# EAGLE design display (EAGLE 4.16)
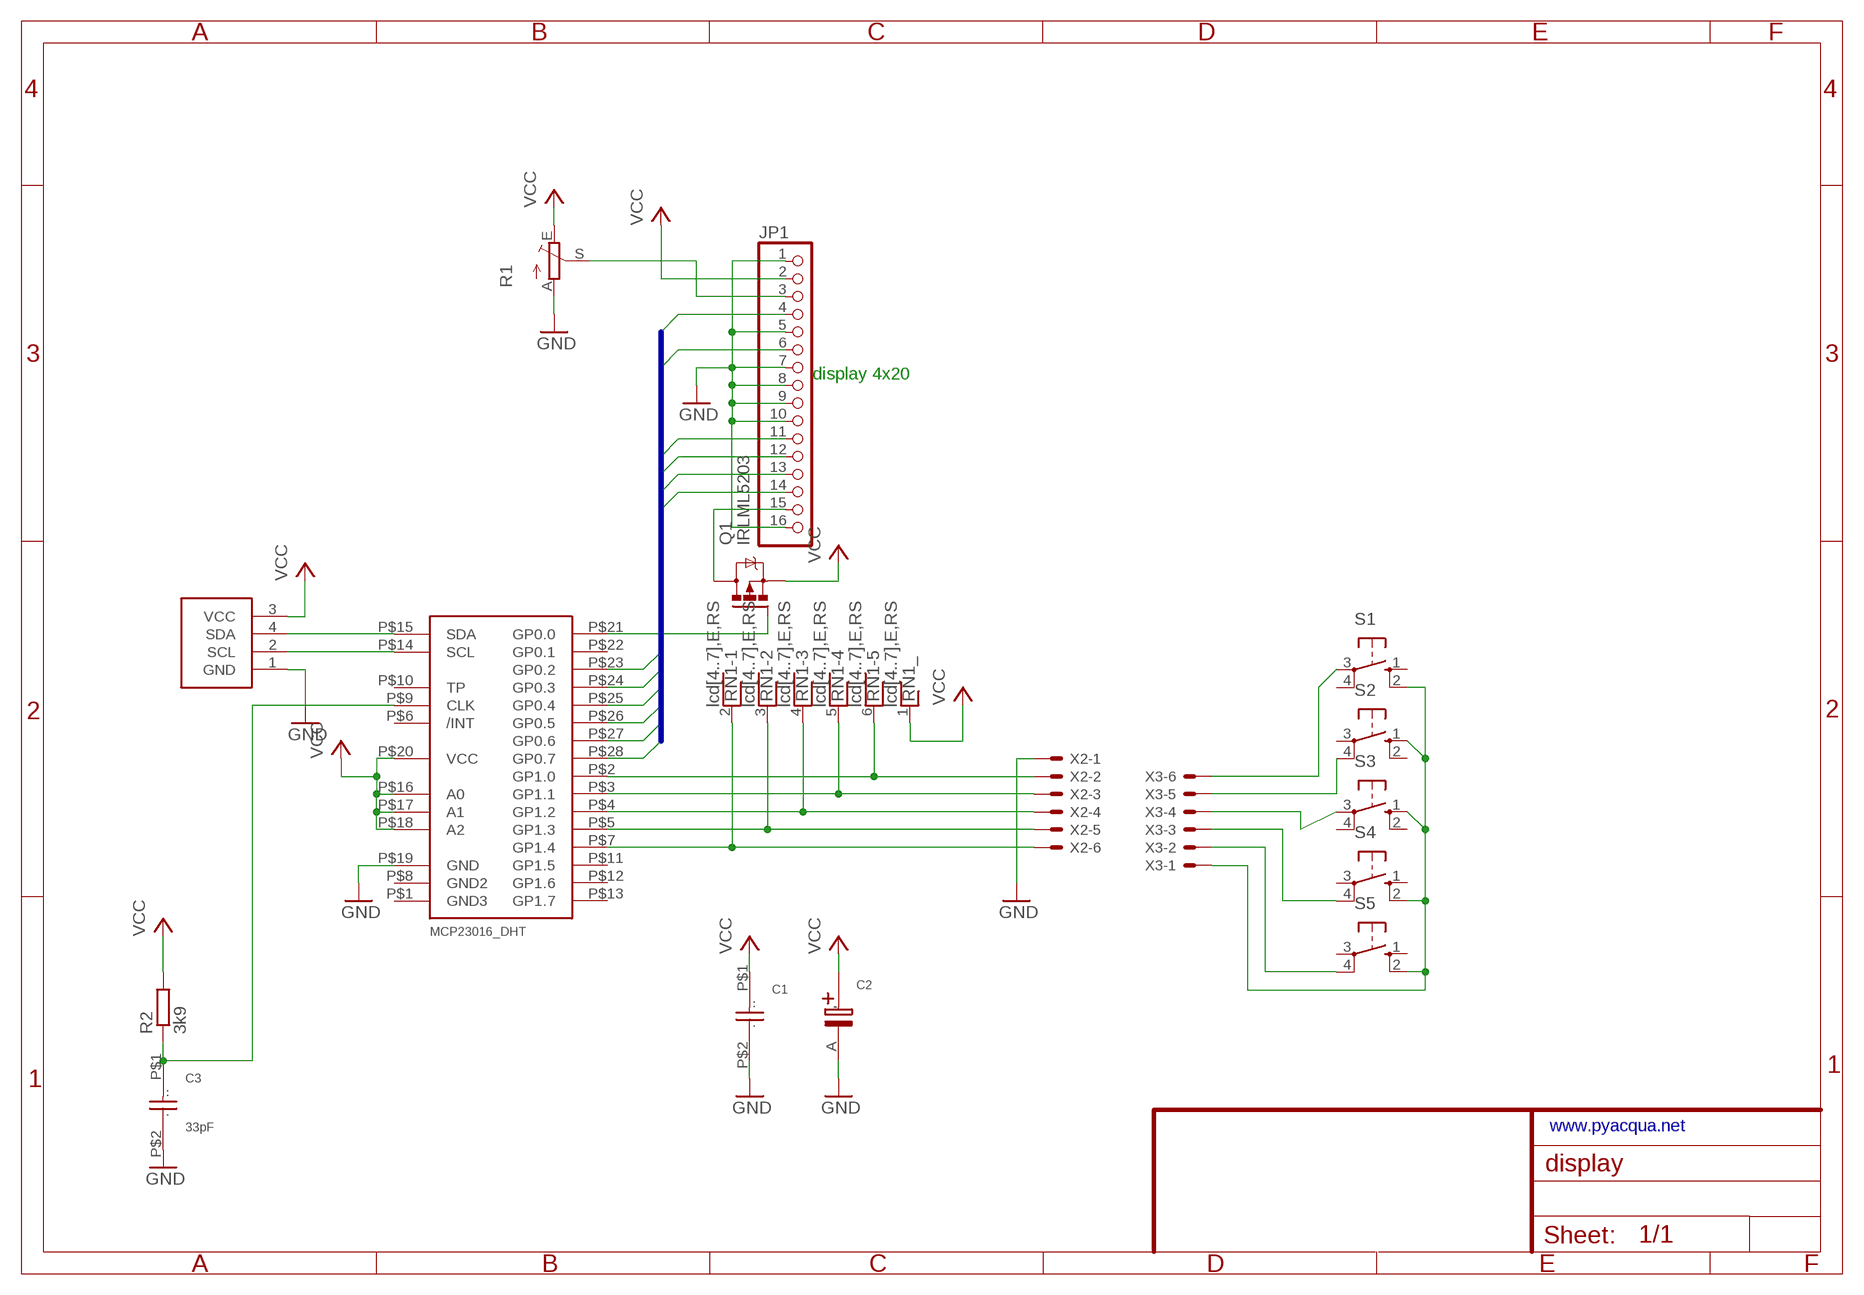
[diagram p0: schematic, sheet 1]

## Parts
C1  CAP_POLI  [CAP_POLI]
C2  CAP_ELET  [CAP_ELET]
C3  33pF  CAP_POLI  [CAP_POLI]
JP1  PINHD-1X16  [1X16]
Q1  IRLML5203  [MICRO3]
R1  TRIM_EU-LI10  [LI10]
R2  3k9  R-EU_0207/2V  [0207/2V]
RN1  lcd[4..7],E,RS  RNX5  [RN-6]
S1  10-XX  [B3F-10XX]
S2  10-XX  [B3F-10XX]
S3  10-XX  [B3F-10XX]
S4  10-XX  [B3F-10XX]
S5  10-XX  [B3F-10XX]
U$1  MCP23016_DHT  [MCP23016_DHT]
U$3  J-I2C  [J-I2C]
X2  22-23-2061  [22-23-2061]
X3  22-23-2061  [22-23-2061]

## Nets
D4: JP1.11 U$1.P$25(GP0.4)
D5: JP1.12 U$1.P$26(GP0.5)
D6: JP1.13 U$1.P$27(GP0.6)
D7: JP1.14 U$1.P$28(GP0.7)
E: JP1.6 U$1.P$24(GP0.3)
GND: C1.P$2(..) C2.A(') C3.P$2(..) JP1.1 JP1.5 JP1.7 JP1.8 JP1.9 JP1.10 JP1.16 R1.A U$1.P$19(GND) U$3.1(GND) X2.1
N$1: S1.2(S1) S2.1(S) S3.1(S) S4.2(S1) S5.2(S1) X3.1
N$2: U$1.P$14(SCL) U$3.2(SCL)
N$3: U$1.P$15(SDA) U$3.4(SDA)
N$4: Q1.1(G) U$1.P$21(GP0.0)
N$5: S5.4(P1) X3.2
N$6: S4.4(P1) X3.3
N$7: S3.3(P) X3.4
N$8: S2.4(P1) X3.5
N$9: S1.3(P) X3.6
N$10: JP1.3 R1.S
N$11: JP1.15 Q1.3(D)
N$12: C3.P$1(.) R2.1 U$1.P$9(CLK)
N$23: RN1.6 U$1.P$2(GP1.0) X2.2
N$30: RN1.5 U$1.P$3(GP1.1) X2.3
N$44: RN1.4 U$1.P$4(GP1.2) X2.4
N$45: RN1.3 U$1.P$5(GP1.3) X2.5
N$46: RN1.2 U$1.P$7(GP1.4) X2.6
RS: JP1.4 U$1.P$23(GP0.2)
VCC: C1.P$1(.) C2.B(.) JP1.2 Q1.2(S) R1.E RN1.1 U$1.P$16(A0) U$1.P$17(A1) U$1.P$18(A2) U$1.P$20(VCC) U$3.3(VCC)
Unconnected: R2.2 S1.1(S) S1.4(P1) S2.2(S1) S2.3(P) S3.2(S1) S3.4(P1) S4.1(S) S4.3(P) S5.1(S) S5.3(P) U$1.P$6(/INT) U$1.P$10(TP) U$1.P$11(GP1.5) U$1.P$12(GP1.6) U$1.P$13(GP1.7) U$1.P$22(GP0.1)

## Buses
D[4..7],E,RS

## Notes on the sheet
- display 4x20
- www.pyacqua.net

## Power pins joined to a net without a drawn wire
GND2: U$1.P$8(GND2)
GND3: U$1.P$1(GND3)

## Library data of the parts
C1 C3 = aggiunte:CAP_POLI: Condensatore non elett passo 5.08 mm (2 x 2.54)
C2 = aggiunte:CAP_ELET: Condensatore elett. passo 2.54 mm
JP1 = pinhead:PINHD-1X16: PIN HEADER
Q1 = transistor-power:IRLML5203: HEXFET P-Channel Power MOSFET
R1 = pot:TRIM_EU-: POTENTIOMETER
R2 = rcl:R-EU_: RESISTOR, European symbol
RN1 = resistor-net:RNX5: RESISTOR NETWORK
S1-S5 = switch-omron:10-XX: OMRON SWITCH
U$1 = aggiunte:MCP23016_DHT: MCP23016 I2C expander a 16 bit
U$3 = aggiunte:J-I2C: connettore 4polare telefonico usatro x i2c
X2 X3 = con-molex:22-23-2061: .100" (2.54mm) Center Header - 6 Pin

## Net classes
0 default: width 0.762 mm

## Board
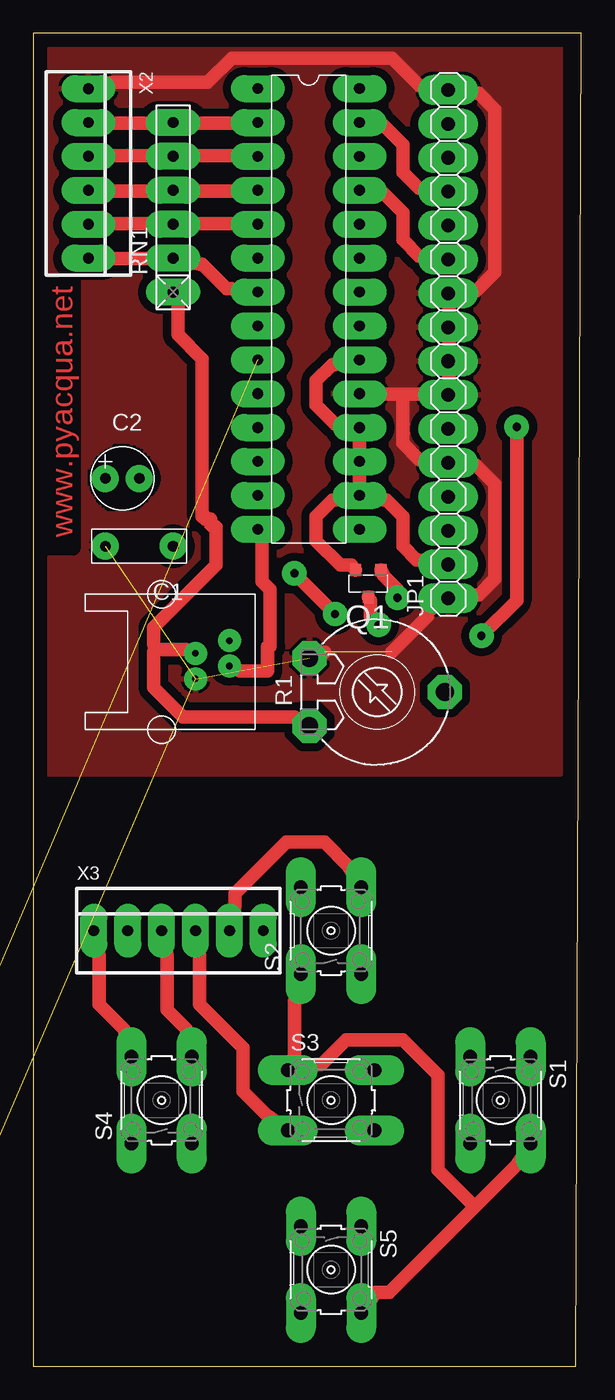
[diagram p1: board, top side]
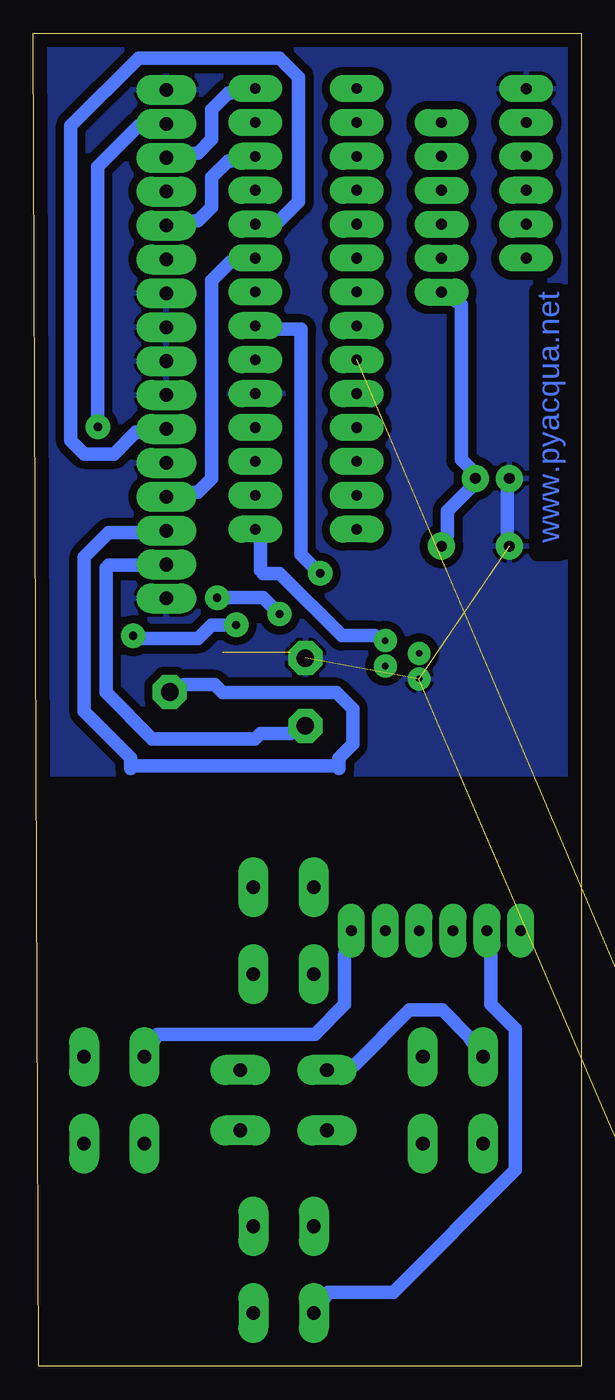
[diagram p2: board, bottom side, seen from below]

Size 41.07 x 99.85 mm. Coordinates in mm from the lower left corner, seen from the top.
Outline: 0,99.85 0,0 40.67,0 41.07,99.85 0,99.85
Copper layers (1*16): Top 0.035mm / dielectric 1.5mm / Bottom 0.035mm
Design rules "mio2": minimum track width 40mil, minimum drill 24mil, track to track 24mil, track to pad 24mil, pad to pad 24mil, via to via 24mil, smd to smd 24mil, copper to edge 40mil, drill to drill 8mil, minimum pad ring 24mil, minimum via ring 24mil, stop-mask expansion 4mil, vias tented up to drill 0mil, thermal gap 10mil

### Footprints (pad centres in the part's own frame; a part is rotated, then mirrored left to right if it is on the bottom)
CAP_POLI = drill 0.8 pad 1.93 round: P$1 -5.08,0; P$2 0,0
CAP_ELET = drill 0.8 pad 1.93 round: A -2.54,0; B 0,0
1X16 = drill 1.016 long: 1 -19.05,0; 2 -16.51,0; 3 -13.97,0; 4 -11.43,0; 5 -8.89,0; 6 -6.35,0; 7 -3.81,0; 8 -1.27,0; 9 1.27,0; 10 3.81,0; 11 6.35,0; 12 8.89,0; 13 11.43,0; 14 13.97,0; 15 16.51,0; 16 19.05,0
MICRO3 = smd 0.8 x 0.9: 1 -0.95,-1; 2 0.95,-1; 3 0,1
LI10 = drill 1.321 octagon: A -2.54,-5.08; E 2.54,-5.08; S 0,5.08
0207/2V = drill 0.813 octagon: 1 -1.27,0; 2 1.27,0
RN-6 = drill 0.813 long: 1 -6.35,0; 2 -3.81,0; 3 -1.27,0; 4 1.27,0; 5 3.81,0; 6 6.35,0
B3F-10XX = drill 1.016 long: 1 -3.251,2.261; 2 3.251,2.261; 3 -3.251,-2.261; 4 3.251,-2.261
MCP23016_DHT = drill 0.8 long: P$1 0,0; P$2 2.54,0; P$3 5.08,0; P$4 7.62,0; P$5 10.16,0; P$6 12.7,0; P$7 15.24,0; P$8 17.78,0; P$9 20.32,0; P$10 22.86,0; P$11 25.4,0; P$12 27.94,0; P$13 30.48,0; P$14 33.02,0; P$15 33.02,7.62; P$16 30.48,7.62; P$17 27.94,7.62; P$18 25.4,7.62; P$19 22.86,7.62; P$20 20.32,7.62; P$21 17.78,7.62; P$22 15.24,7.62; P$23 12.7,7.62; P$24 10.16,7.62; P$25 7.62,7.62; P$26 5.08,7.62; P$27 2.54,7.62; P$28 0,7.62
J-I2C = drill 0.5 pad 1.27 round: 1 -2.54,-0.635; 2 0,0.318; 3 -2.54,1.27; 4 0,2.223
22-23-2061 = drill 0.813 long: 1 -6.35,0; 2 -3.81,0; 3 -1.27,0; 4 1.27,0; 5 3.81,0; 6 6.35,0

### Placement (x,y rotation side)
C1  5.4,61.43 180 top
C2  7.94,66.51 0 top
C3  -50.28,-94.07 0 top  (outside the outline)
JP1  31.1,76.57 90 top
Q1  25.11,58.63 180 top
R1  25.77,50.51 270 top
R2  -56.63,-104.23 0 top  (outside the outline)
RN1  10.48,86.83 90 top
S1  35.01,19.92 270 top
S2  22.31,32.62 90 top
S3  22.31,19.92 0 top
S4  9.61,19.92 90 top
S5  22.31,7.22 270 top
U$1  16.83,95.72 270 top
U$2  [A4P-LOC]  -62.12,-87.31 0 top  (outside the outline)
U$3  14.69,52.13 0 top
X2  4.13,89.37 270 top
X3  10.88,32.62 0 top

### Tracks (layer width: path | path; a pad name or v marks a point on that pad's centre or on a via)
D4
  Top 1.016: U$1.P$25 26.28,87.84 27.7,86.42 27.7,84.39 28.92,83.17 JP1.11
D5
  Bottom 1.016: U$1.P$26 26.28,90.28 26.48,90.28 27.7,89.06 27.7,86.83 28.71,85.81 28.92,85.81 JP1.12
D6
  Top 1.016: U$1.P$27 26.28,92.92 27.7,91.5 27.7,89.47 28.92,88.25 JP1.13
D7
  Bottom 1.016: U$1.P$28 26.28,95.36 26.48,95.36 27.7,94.14 27.7,91.91 28.71,90.89 28.92,90.89 JP1.14
E
  Bottom 1.016: U$1.P$24 22.62,85.81 21.2,87.23 21.2,96.58 22.62,98 33.18,98 38.26,92.92 38.26,69.35 37.25,68.34 35.01,68.34 33.39,69.96 33.18,69.96 JP1.6
GND  (4 unrouted)
  Top 1.016: X2.1 5.96,96.17 13.07,96.17 14.9,98 26.89,98 28.92,95.97 JP1.16 33.18,95.36 33.39,95.36 34.61,94.14 34.61,81.95 33.18,80.53 JP1.10 31.15,79.31 31.15,78.9 JP1.9 31.15,76.87 31.15,76.26 JP1.8 31.15,74.23 31.15,73.82 JP1.7 28.92,72.81 27.7,72.81 | 27.7,72.81 26.28,72.81 U$1.P$19 | 27.7,72.81 27.7,69.15 28.92,67.93 JP1.5 33.18,67.52 34.61,66.1 34.61,58.99 33.39,57.77 33.18,57.77 JP1.1 29.53,56.55 29.53,56.14 26.89,53.5 | R1.A 21.81,53.5
  Bottom 1.016: C1.P$2 5.55,62.24 5.55,65.69 C2.A
  pour Bottom: 0.47,99.22 39.89,99.22 39.89,44.36 0.47,44.36
  pour Top: 0.88,98.82 39.48,98.82 39.48,44.36 0.88,44.36
N$1
  Top 1.016: S2.1 19.57,27.29 19.57,23.23 S3.1 21.2,22.62 21.6,22.62 23.43,24.44 27.7,24.44 30.34,21.8 30.34,14.69 33.08,11.95 | X3.1 4.94,30.74 4.94,27.09 6.77,25.26 S4.2 | 33.08,11.95 36.23,15.1 S1.2 | 33.08,11.95 26.68,5.55 25.67,5.55 S5.2
  Bottom 1.016: S3.1 16.93,22.62 12.86,26.68 10.43,26.68 8.39,24.65 S4.2
N$2
  Top 1.016: U$3.2 15.51,52.08 17.54,52.08 17.54,53.91 17.74,53.91 17.74,58.18 17.13,58.79 17.13,61.83 U$1.P$14
N$3
  Bottom 1.016: U$3.4 15.51,54.72 17.94,54.72 22.62,59.4 23.84,59.4 24.04,59.6 24.04,61.83 U$1.P$15
N$4  (via drill 0.61)
  Top 1.016: Q1.1 26.28,59.19 27.29,58.18 v27.29,57.57 | v19.57,59.4 v22.62,56.35
  Bottom 1.016: v27.29,57.57 23.84,57.57 v22.62,56.35 | v19.57,59.4 20.99,60.82 20.99,77.68 22.62,77.68 U$1.P$21
N$5
  Bottom 1.016: X3.2 6.77,30.74 6.77,27.09 4.94,25.26 4.94,14.69 14.08,5.55 18.96,5.55 S5.4
N$6
  Top 1.016: X3.3 10.02,30.74 10.02,26.68 11.44,25.26 S4.4
N$7
  Top 1.016: X3.4 12.46,30.74 12.46,27.09 15.71,23.84 15.71,20.58 17.54,18.76 S3.3
N$8
  Top 1.016: X3.5 15.1,34.6 15.1,35.42 18.96,39.28 21.81,39.28 23.63,37.45 S2.4
N$9
  Bottom 1.016: X3.6 17.74,30.74 17.74,27.09 19.98,24.85 31.76,24.85 S1.3
N$10
  Bottom 1.016: JP1.3 33.18,62.44 35.42,62.44 37.25,60.61 37.25,49.03 33.79,45.58 33.79,44.76 33.59,44.97 18.35,44.97 18.15,44.76 18.15,45.58 17.13,46.59 17.13,49.24 18.35,50.45 26.89,50.45 27.5,51.06 29.73,51.06 R1.S
N$11  (via drill 0.61)
  Top 1.016: v25.87,55.53 25.26,56.14 25.26,57.36 Q1.3 | v33.59,54.72 36.23,57.36 v36.23,70.37
  Bottom 1.016: v36.23,70.37 36.23,89.88 33.18,92.92 JP1.15 | v25.87,55.53 27.7,55.53 28.71,54.52 33.39,54.52 v33.59,54.72
N$12  (2 unrouted)
N$23
  Top 1.016: U$1.P$2 14.9,93.13 12.46,93.13 RN1.6 8.6,93.13 5.96,93.13 X2.2
N$30
  Top 1.016: U$1.P$3 14.9,90.69 12.46,90.69 RN1.5 8.6,90.69 5.96,90.69 X2.3
N$44
  Top 1.016: U$1.P$4 14.9,88.05 12.46,88.05 RN1.4 8.6,88.05 5.96,88.05 X2.4
N$45
  Top 1.016: U$1.P$5 14.9,85.61 12.46,85.61 RN1.3 8.6,85.61 5.96,85.61 X2.5
N$46
  Top 1.016: U$1.P$7 14.9,80.73 14.49,80.73 12.66,82.56 12.46,82.56 RN1.2 8.6,82.97 5.96,82.97 X2.6
RS
  Bottom 1.016: U$1.P$23 26.28,82.76 27.7,81.34 27.7,66.51 28.71,65.49 28.92,65.49 JP1.4
VCC
  Top 1.016: U$1.P$20 22.62,75.04 22.42,75.04 21.2,73.82 21.2,71.99 22.62,70.57 U$1.P$18 U$1.P$17 U$1.P$16 | Q1.2 23.84,60 23.02,60 21.2,61.83 21.2,63.66 22.42,64.88 22.62,64.88 U$1.P$16 | JP1.2 28.92,60.41 28.71,60.41 27.7,61.43 27.7,63.66 26.48,64.88 26.28,64.88 U$1.P$16 | 9.21,53.71 11.44,53.71 U$3.3 | 9.21,53.71 9,53.5 9,50.86 11.24,48.63 19.57,48.63 R1.E | 9.21,53.71 9,54.11 9,55.33 13.68,60 13.68,62.85 13.47,62.85 13.47,63.05 13.27,63.05 13.27,63.46 12.86,63.46 12.86,63.66 12.66,63.66 12.66,75.45 10.83,77.28 10.83,79.51 RN1.1
  Bottom 1.016: C1.P$1 10.02,62.24 10.02,64.07 8.39,65.69 C2.B 8.39,67.32 9,67.93 9,79.51 RN1.1 | JP1.2 33.18,60 35.42,60 35.62,59.8 35.62,50.45 32.17,47 24.45,47 24.04,47.41 21.81,47.41 R1.E

### Text on the board
Top: www.pyacqua.net
Bottom: www.pyacqua.net | PYACQUA | PYACQUA
Pads: www.pyacqua.net